# EAGLE schematic actuatorBoard_2 (EAGLE 7.7.0)
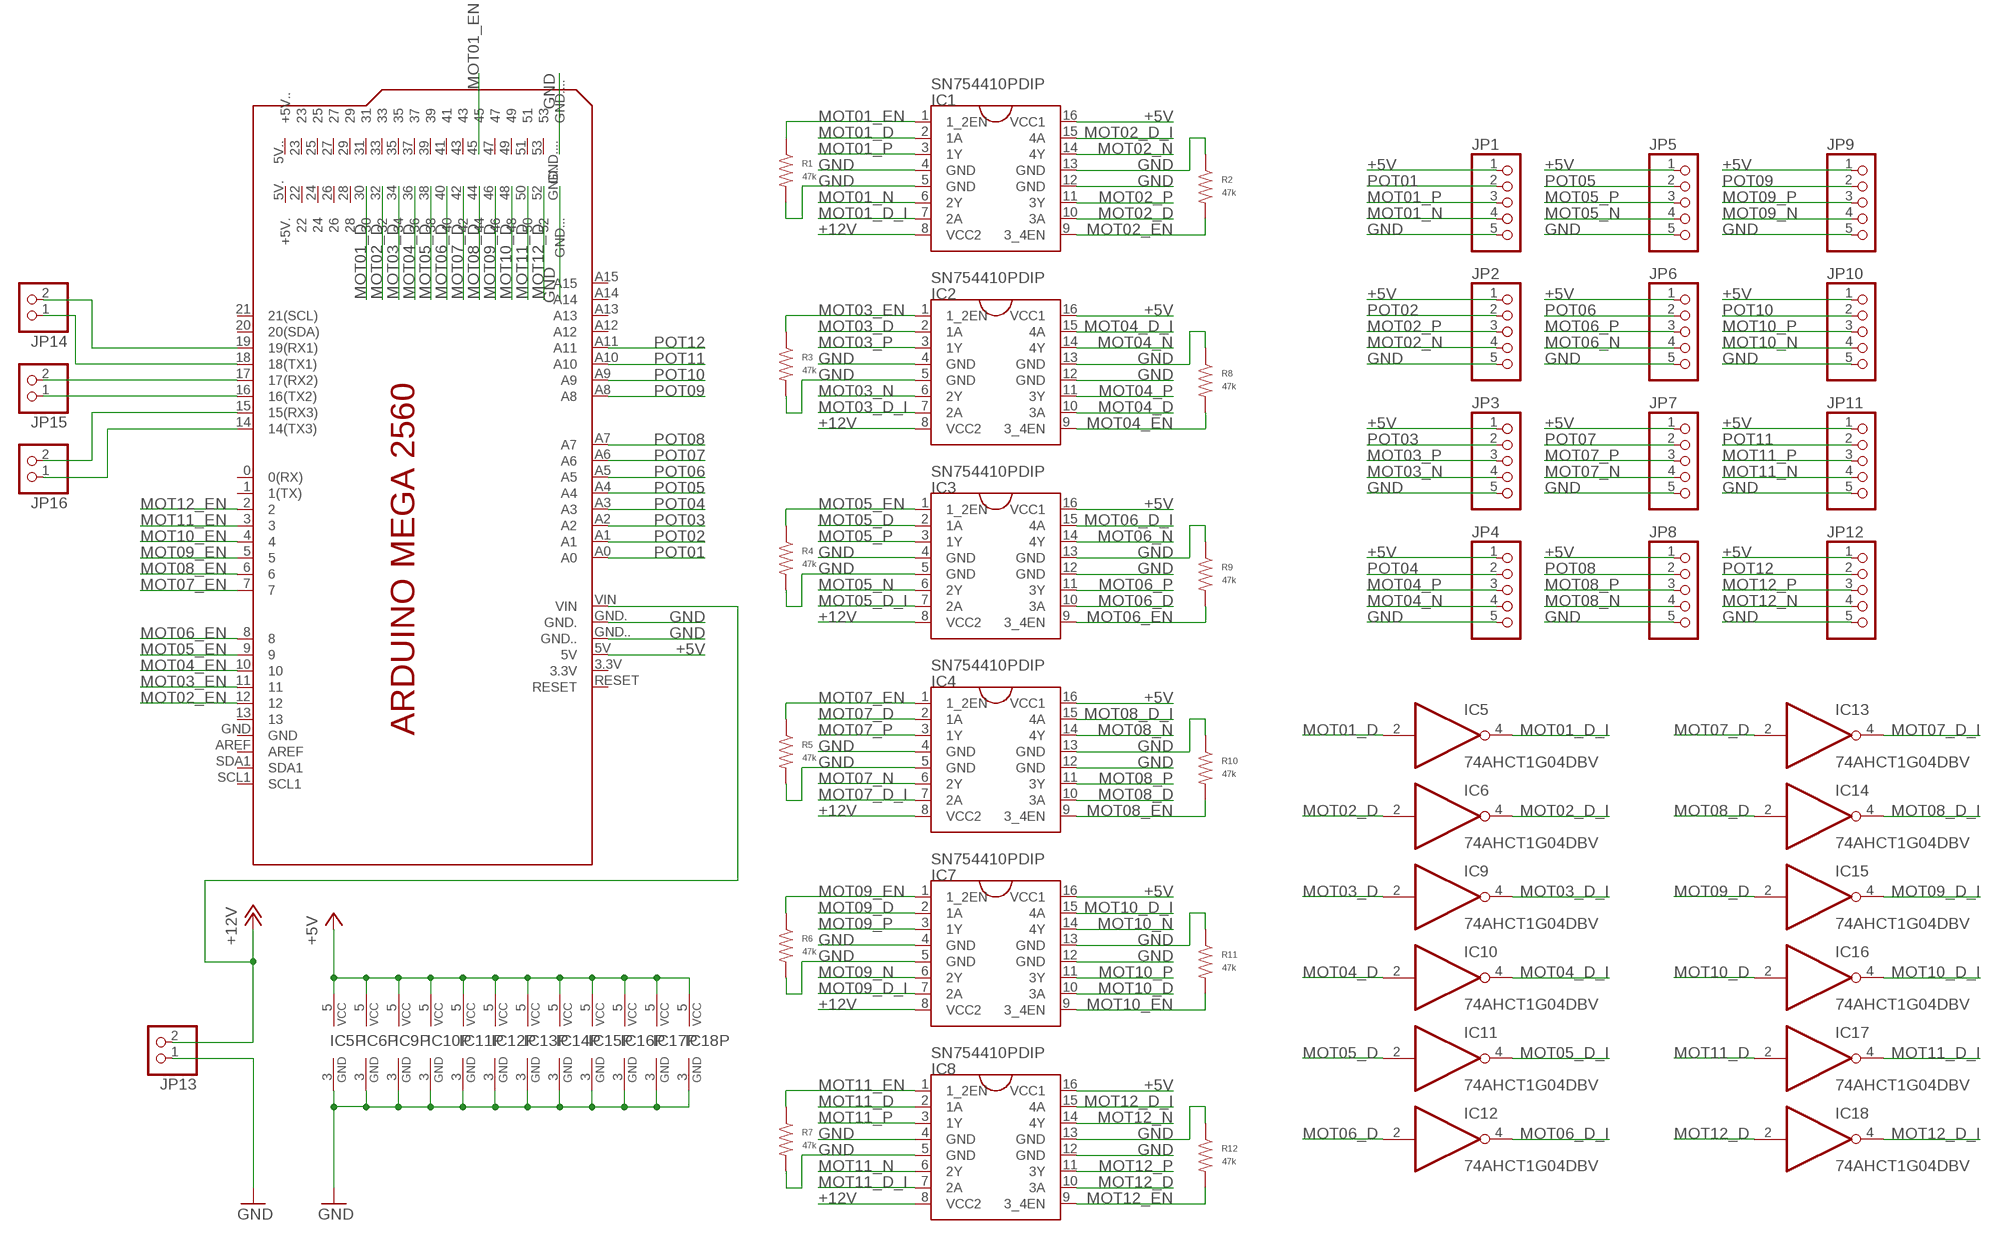
[diagram p0: schematic, sheet 1]

## Parts
IC1  SN754410PDIP  [DIL16]
IC2  SN754410PDIP  [DIL16]
IC3  SN754410PDIP  [DIL16]
IC4  SN754410PDIP  [DIL16]
IC5  74AHCT1G04DBV  [SOT23-5]
IC6  74AHCT1G04DBV  [SOT23-5]
IC7  SN754410PDIP  [DIL16]
IC8  SN754410PDIP  [DIL16]
IC9  74AHCT1G04DBV  [SOT23-5]
IC10  74AHCT1G04DBV  [SOT23-5]
IC11  74AHCT1G04DBV  [SOT23-5]
IC12  74AHCT1G04DBV  [SOT23-5]
IC13  74AHCT1G04DBV  [SOT23-5]
IC14  74AHCT1G04DBV  [SOT23-5]
IC15  74AHCT1G04DBV  [SOT23-5]
IC16  74AHCT1G04DBV  [SOT23-5]
IC17  74AHCT1G04DBV  [SOT23-5]
IC18  74AHCT1G04DBV  [SOT23-5]
JP1  PINHD-1X5  [1X05]
JP2  PINHD-1X5  [1X05]
JP3  PINHD-1X5  [1X05]
JP4  PINHD-1X5  [1X05]
JP5  PINHD-1X5  [1X05]
JP6  PINHD-1X5  [1X05]
JP7  PINHD-1X5  [1X05]
JP8  PINHD-1X5  [1X05]
JP9  PINHD-1X5  [1X05]
JP10  PINHD-1X5  [1X05]
JP11  PINHD-1X5  [1X05]
JP12  PINHD-1X5  [1X05]
JP13  PINHD-1X2  [1X02]
JP14  PINHD-1X2  [1X02]
JP15  PINHD-1X2  [1X02]
JP16  PINHD-1X2  [1X02]
PCB1  ARDUINO_MEGA2560  [ARDUINO_MEGA2560]
R1  47k  RESISTOR_0603  [R0603]
R2  47k  RESISTOR_0603  [R0603]
R3  47k  RESISTOR_0603  [R0603]
R4  47k  RESISTOR_0603  [R0603]
R5  47k  RESISTOR_0603  [R0603]
R6  47k  RESISTOR_0603  [R0603]
R7  47k  RESISTOR_0603  [R0603]
R8  47k  RESISTOR_0603  [R0603]
R9  47k  RESISTOR_0603  [R0603]
R10  47k  RESISTOR_0603  [R0603]
R11  47k  RESISTOR_0603  [R0603]
R12  47k  RESISTOR_0603  [R0603]

## Nets
+5V: IC1.16(VCC1) IC2.16(VCC1) IC3.16(VCC1) IC4.16(VCC1) IC5.5(VCC) IC6.5(VCC) IC7.16(VCC1) IC8.16(VCC1) IC9.5(VCC) IC10.5(VCC) IC11.5(VCC) IC12.5(VCC) IC13.5(VCC) IC14.5(VCC) IC15.5(VCC) IC16.5(VCC) IC17.5(VCC) IC18.5(VCC) JP1.1 JP2.1 JP3.1 JP4.1 JP5.1 JP6.1 JP7.1 JP8.1 JP9.1 JP10.1 JP11.1 JP12.1 PCB1.5V
+12V: IC1.8(VCC2) IC2.8(VCC2) IC3.8(VCC2) IC4.8(VCC2) IC7.8(VCC2) IC8.8(VCC2) JP13.2 PCB1.VIN
GND: IC1.4(GND) IC1.5(GND) IC1.12(GND) IC1.13(GND) IC2.4(GND) IC2.5(GND) IC2.12(GND) IC2.13(GND) IC3.4(GND) IC3.5(GND) IC3.12(GND) IC3.13(GND) IC4.4(GND) IC4.5(GND) IC4.12(GND) IC4.13(GND) IC5.3(GND) IC6.3(GND) IC7.4(GND) IC7.5(GND) IC7.12(GND) IC7.13(GND) IC8.4(GND) IC8.5(GND) IC8.12(GND) IC8.13(GND) IC9.3(GND) IC10.3(GND) IC11.3(GND) IC12.3(GND) IC13.3(GND) IC14.3(GND) IC15.3(GND) IC16.3(GND) IC17.3(GND) IC18.3(GND) JP1.5 JP2.5 JP3.5 JP4.5 JP5.5 JP6.5 JP7.5 JP8.5 JP9.5 JP10.5 JP11.5 JP12.5 JP13.1 PCB1.GND. PCB1.GND.. PCB1.GND... PCB1.GND.... R1.P$2 R2.P$1 R3.P$2 R4.P$2 R5.P$2 R6.P$2 R7.P$2 R8.P$1 R9.P$1 R10.P$1 R11.P$1 R12.P$1
MOT01_D: IC1.2(1A) IC5.2(I) PCB1.30
MOT01_D_I: IC1.7(2A) IC5.4(O)
MOT01_EN: IC1.1(1_2EN) PCB1.45 R1.P$1
MOT01_N: IC1.6(2Y) JP1.4
MOT01_P: IC1.3(1Y) JP1.3
MOT02_D: IC1.10(3A) IC6.2(I) PCB1.32
MOT02_D_I: IC1.15(4A) IC6.4(O)
MOT02_EN: IC1.9(3_4EN) PCB1.12 R2.P$2
MOT02_N: IC1.14(4Y) JP2.4
MOT02_P: IC1.11(3Y) JP2.3
MOT03_D: IC2.2(1A) IC9.2(I) PCB1.34
MOT03_D_I: IC2.7(2A) IC9.4(O)
MOT03_EN: IC2.1(1_2EN) PCB1.11 R3.P$1
MOT03_N: IC2.6(2Y) JP3.4
MOT03_P: IC2.3(1Y) JP3.3
MOT04_D: IC2.10(3A) IC10.2(I) PCB1.36
MOT04_D_I: IC2.15(4A) IC10.4(O)
MOT04_EN: IC2.9(3_4EN) PCB1.10 R8.P$2
MOT04_N: IC2.14(4Y) JP4.4
MOT04_P: IC2.11(3Y) JP4.3
MOT05_D: IC3.2(1A) IC11.2(I) PCB1.38
MOT05_D_I: IC3.7(2A) IC11.4(O)
MOT05_EN: IC3.1(1_2EN) PCB1.9 R4.P$1
MOT05_N: IC3.6(2Y) JP5.4
MOT05_P: IC3.3(1Y) JP5.3
MOT06_D: IC3.10(3A) IC12.2(I) PCB1.40
MOT06_D_I: IC3.15(4A) IC12.4(O)
MOT06_EN: IC3.9(3_4EN) PCB1.8 R9.P$2
MOT06_N: IC3.14(4Y) JP6.4
MOT06_P: IC3.11(3Y) JP6.3
MOT07_D: IC4.2(1A) IC13.2(I) PCB1.42
MOT07_D_I: IC4.7(2A) IC13.4(O)
MOT07_EN: IC4.1(1_2EN) PCB1.7 R5.P$1
MOT07_N: IC4.6(2Y) JP7.4
MOT07_P: IC4.3(1Y) JP7.3
MOT08_D: IC4.10(3A) IC14.2(I) PCB1.44
MOT08_D_I: IC4.15(4A) IC14.4(O)
MOT08_EN: IC4.9(3_4EN) PCB1.6 R10.P$2
MOT08_N: IC4.14(4Y) JP8.4
MOT08_P: IC4.11(3Y) JP8.3
MOT09_D: IC7.2(1A) IC15.2(I) PCB1.46
MOT09_D_I: IC7.7(2A) IC15.4(O)
MOT09_EN: IC7.1(1_2EN) PCB1.5 R6.P$1
MOT09_N: IC7.6(2Y) JP9.4
MOT09_P: IC7.3(1Y) JP9.3
MOT10_D: IC7.10(3A) IC16.2(I) PCB1.48
MOT10_D_I: IC7.15(4A) IC16.4(O)
MOT10_EN: IC7.9(3_4EN) PCB1.4 R11.P$2
MOT10_N: IC7.14(4Y) JP10.4
MOT10_P: IC7.11(3Y) JP10.3
MOT11_D: IC8.2(1A) IC17.2(I) PCB1.50
MOT11_D_I: IC8.7(2A) IC17.4(O)
MOT11_EN: IC8.1(1_2EN) PCB1.3 R7.P$1
MOT11_N: IC8.6(2Y) JP11.4
MOT11_P: IC8.3(1Y) JP11.3
MOT12_D: IC8.10(3A) IC18.2(I) PCB1.52
MOT12_D_I: IC8.15(4A) IC18.4(O)
MOT12_EN: IC8.9(3_4EN) PCB1.2 R12.P$2
MOT12_N: IC8.14(4Y) JP12.4
MOT12_P: IC8.11(3Y) JP12.3
N$1: JP15.2 PCB1.17(17(RX2))
N$2: JP15.1 PCB1.16(16(TX2))
N$3: JP14.1 PCB1.18(18(TX1))
N$4: JP14.2 PCB1.19(19(RX1))
N$5: JP16.2 PCB1.15(15(RX3))
N$6: JP16.1 PCB1.14(14(TX3))
POT01: JP1.2 PCB1.A0
POT02: JP2.2 PCB1.A1
POT03: JP3.2 PCB1.A2
POT04: JP4.2 PCB1.A3
POT05: JP5.2 PCB1.A4
POT06: JP6.2 PCB1.A5
POT07: JP7.2 PCB1.A6
POT08: JP8.2 PCB1.A7
POT09: JP9.2 PCB1.A8
POT10: JP10.2 PCB1.A9
POT11: JP11.2 PCB1.A10
POT12: JP12.2 PCB1.A11
Unconnected: PCB1.0(0(RX)) PCB1.1(1(TX)) PCB1.3.3V PCB1.5V.(+5V.) PCB1.5V..(+5V..) PCB1.13 PCB1.20(20(SDA)) PCB1.21(21(SCL)) PCB1.22 PCB1.23 PCB1.24 PCB1.25 PCB1.26 PCB1.27 PCB1.28 PCB1.29 PCB1.31 PCB1.33 PCB1.35 PCB1.37 PCB1.39 PCB1.41 PCB1.43 PCB1.47 PCB1.49 PCB1.51 PCB1.53 PCB1.A12 PCB1.A13 PCB1.A14 PCB1.A15 PCB1.AREF PCB1.GND PCB1.RESET PCB1.SCL1 PCB1.SDA1

## Library data of the parts
IC1-IC4 IC7 IC8 = AlexW-Eagle-Libraries:SN754410
IC5 IC6 IC9-IC18 = 74xx-little-us:74*1G04: INVERTER Gate
JP1-JP12 = pinhead:PINHD-1X5: PIN HEADER
JP13-JP16 = pinhead:PINHD-1X2: PIN HEADER
PCB1 = arduino_mega:ARDUINO_MEGA2560: Device for representing an Arduino Mega 2560 board with a footprint in an EAGLE design. Created by Dave Young for Element14. More EAGLE documentation at: http://www.element14.com/community/community/knode/cadsoft_eagle
R1-R12 = MF_Passives:RESISTOR: Library: MF_Passives Description: Device for Resistors. Manufacture part number (MPN), Voltage, Tolerance, and Wattage Rating can be added via Attributes. Check https://factory.macrofab.com/parts for the house parts list.; POPULATE: 1